# Altium schematic sheet CONNS.SchDoc
size A4; SheetNumber: 9; SheetTotal: 9
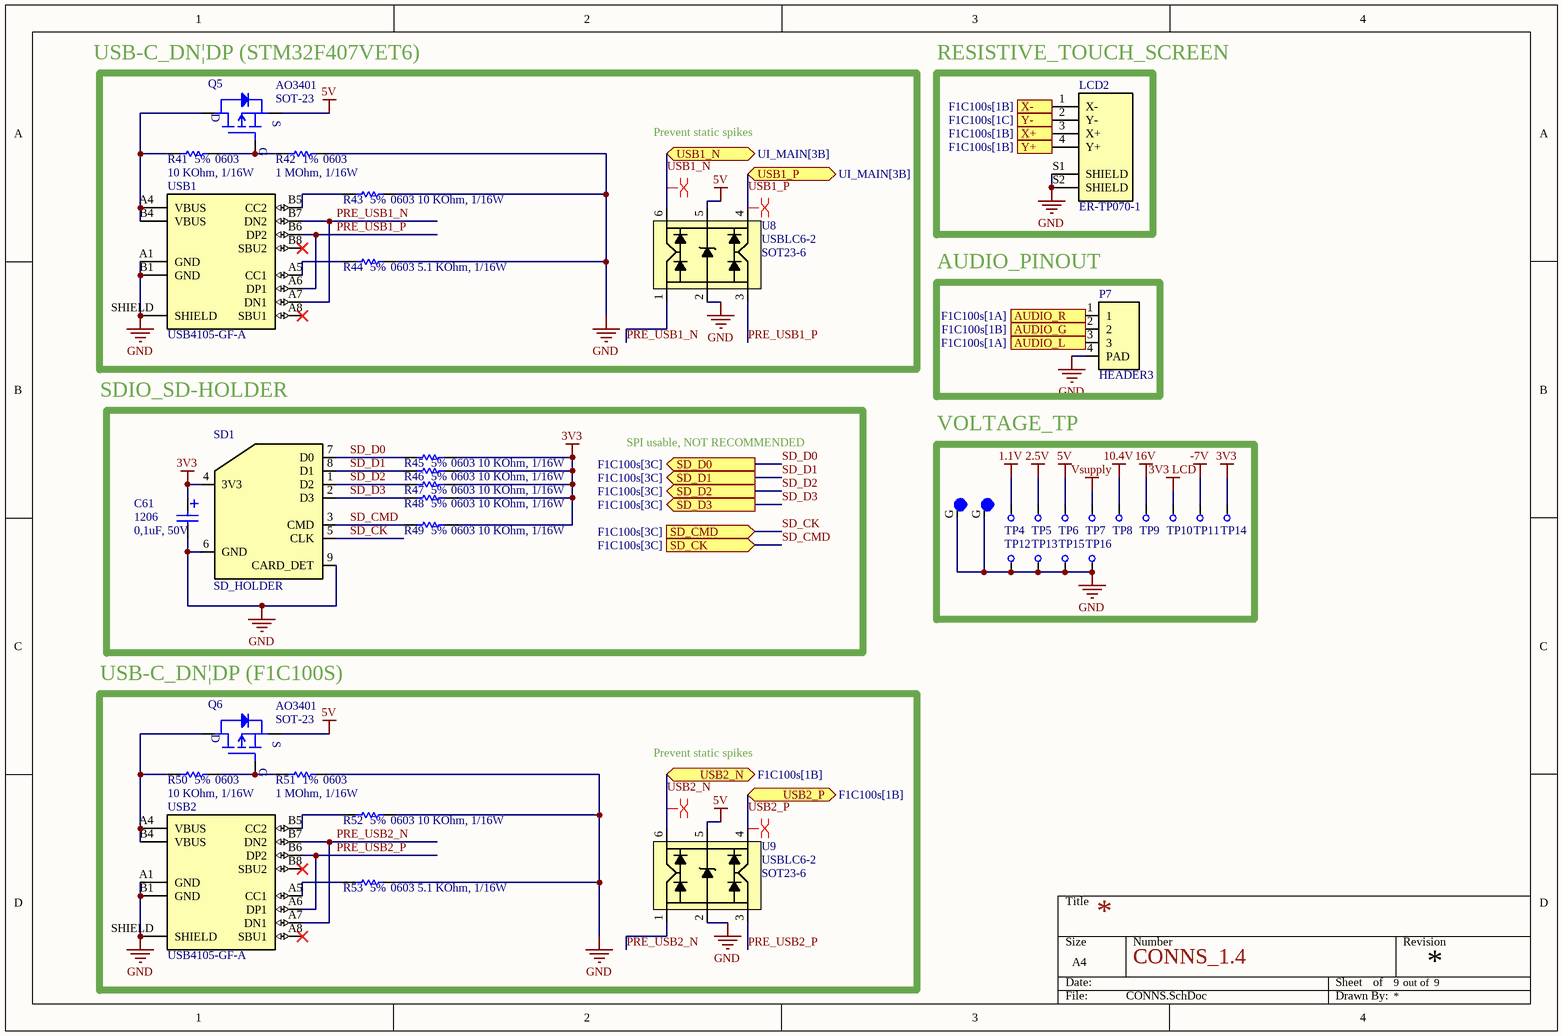
[diagram p0: CONNS.SchDoc]

## Parts
C61  Package: 1206  [C_1206+]  (hidden comment: 0,1uF, 50V)
LCD2  ER-TP070-1  [ER-TP070-1]
M1  MOUNTING_HOLE  [HOLES]  (value not drawn)  (no BOM)
M2  MOUNTING_HOLE  [HOLES]  (value not drawn)  (no BOM)
P7  HEADER3  [CONN_Header3]
Q5  AO3401  Package: SOT-23  [PKG_SOT-23]
Q6  AO3401  Package: SOT-23  [PKG_SOT-23]
R41  Package: 0603  Acc: 5%  [R_0603]  (hidden comment: 10 KOhm, 1/16W)
R42  Package: 0603  Acc: 1%  [R_0603]  (hidden comment: 1 MOhm, 1/16W)
R43  Package: 0603  Acc: 5%  [R_0603]  (hidden comment: 10 KOhm, 1/16W)
R44  Package: 0603  Acc: 5%  [R_0603]  (hidden comment: 5.1 KOhm, 1/16W)
R45  Package: 0603  Acc: 5%  [R_0603]  (hidden comment: 10 KOhm, 1/16W)
R46  Package: 0603  Acc: 5%  [R_0603]  (hidden comment: 10 KOhm, 1/16W)
R47  Package: 0603  Acc: 5%  [R_0603]  (hidden comment: 10 KOhm, 1/16W)
R48  Package: 0603  Acc: 5%  [R_0603]  (hidden comment: 10 KOhm, 1/16W)
R49  Package: 0603  Acc: 5%  [R_0603]  (hidden comment: 10 KOhm, 1/16W)
R50  Package: 0603  Acc: 5%  [R_0603]  (hidden comment: 10 KOhm, 1/16W)
R51  Package: 0603  Acc: 1%  [R_0603]  (hidden comment: 1 MOhm, 1/16W)
R52  Package: 0603  Acc: 5%  [R_0603]  (hidden comment: 10 KOhm, 1/16W)
R53  Package: 0603  Acc: 5%  [R_0603]  (hidden comment: 5.1 KOhm, 1/16W)
SD1  SD_HOLDER  [CONN_SD_Holder]
TP4  TESTPT  [TESTPT]  (value not drawn)  (no BOM)
TP5  TESTPT  [TESTPT]  (value not drawn)  (no BOM)
TP6  TESTPT  [TESTPT]  (value not drawn)  (no BOM)
TP7  TESTPT  [TESTPT]  (value not drawn)  (no BOM)
TP8  TESTPT  [TESTPT]  (value not drawn)  (no BOM)
TP9  TESTPT  [TESTPT]  (value not drawn)  (no BOM)
TP10  TESTPT  [TESTPT]  (value not drawn)  (no BOM)
TP11  TESTPT  [TESTPT]  (value not drawn)  (no BOM)
TP12  TESTPT  [TESTPT]  (value not drawn)  (no BOM)
TP13  TESTPT  [TESTPT]  (value not drawn)  (no BOM)
TP14  TESTPT  [TESTPT]  (value not drawn)  (no BOM)
TP15  TESTPT  [TESTPT]  (value not drawn)  (no BOM)
TP16  TESTPT  [TESTPT]  (value not drawn)  (no BOM)
U8  USBLC6-2  Pkg: SOT23-6  [PKG-SOT23-6]
U9  USBLC6-2  Pkg: SOT23-6  [PKG-SOT23-6]
USB1  USB4105-GF-A  [CONN_USB-C]
USB2  USB4105-GF-A  [CONN_USB-C]

## Blocks framed on the sheet
Prevent static spikes: Q5 R41-R44 U8 USB1
RESISTIVE_TOUCH_SCREEN: LCD2
AUDIO_PINOUT: P7
SPI usable, NOT RECOMMENDED: C61 R45-R49 SD1
VOLTAGE_TP: M1 M2 TP4-TP16
USB-C_DN|DP (F1C100S): Q6 R50-R53 U9 USB2

## Ports
AUDIO_G (in, see F1C100s[1B]), AUDIO_L (in, see F1C100s[1A]), AUDIO_R (in, see F1C100s[1A]), SD_CK (in, see F1C100s[3C]), SD_CMD (in, see F1C100s[3C]), SD_D0 (out, see F1C100s[3C]), SD_D1 (out, see F1C100s[3C]), SD_D2 (out, see F1C100s[3C]), SD_D3 (out, see F1C100s[3C]), USB1_N (bidir, see UI_MAIN[3B]), USB1_P (bidir, see UI_MAIN[3B]), USB2_N (bidir, see F1C100s[1B]), USB2_P (bidir, see F1C100s[1B]), X+ (out, see F1C100s[1B]), X- (out, see F1C100s[1B]), Y+ (out, see F1C100s[1B]), Y- (out, see F1C100s[1C])

## Nets
1.1V: TP4.1
2.5V: TP5.1
3V3: C61.2 R45.2 R46.2 R47.2 R48.2 R49.2 SD1.4(3V3) TP14.1
3V3 LCD: TP10.1
5V: Q5.2(S) Q6.2(S) TP6.1 U8.5 U9.5
10.4V: TP8.1
16V: TP9.1
-7V: TP11.1
GND: C61.1 LCD2.S1(SHIELD) LCD2.S2(SHIELD) M1.G M2.G P7.4(PAD) R42.2 R43.2 R44.2 R51.2 R52.2 R53.2 SD1.6(GND) SD1.9(CARD_DET) TP12.1 TP13.1 TP15.1 TP16.1 U8.2 U9.2 USB1.A1(GND) USB1.B1(GND) USB1.SHIELD USB2.A1(GND) USB2.B1(GND) USB2.SHIELD
Vsupply: TP7.1
AUDIO_G: P7.2 ; port AUDIO_G
AUDIO_L: P7.3 ; port AUDIO_L
AUDIO_R: P7.1 ; port AUDIO_R
PRE_USB1_N: U8.1 USB1.A7(DN1) USB1.B7(DN2)
PRE_USB1_P: U8.3 USB1.A6(DP1) USB1.B6(DP2)
PRE_USB2_N: U9.1 USB2.A7(DN1) USB2.B7(DN2)
PRE_USB2_P: U9.3 USB2.A6(DP1) USB2.B6(DP2)
SD_CK: SD1.5(CLK) ; port SD_CMD
SD_CMD: R49.1 SD1.3(CMD) ; port SD_CK
SD_D0: R45.1 SD1.7(D0) ; port SD_D0
SD_D1: R46.1 SD1.8(D1) ; port SD_D1
SD_D2: R47.1 SD1.1(D2) ; port SD_D2
SD_D3: R48.1 SD1.2(D3) ; port SD_D3
USB1_N: U8.6 ; port USB1_N
USB1_P: U8.4 ; port USB1_P
USB2_N: U9.6 ; port USB2_N
USB2_P: U9.4 ; port USB2_P
X+: LCD2.3(X+) ; port X+
X-: LCD2.1(X-) ; port X-
Y+: LCD2.4(Y+) ; port Y+
Y-: LCD2.2(Y-) ; port Y-
NetQ5_1: Q5.1(G) R41.2 R42.1
NetQ5_3: Q5.3(D) R41.1 USB1.A4(VBUS) USB1.B4(VBUS)
NetQ6_1: Q6.1(G) R50.2 R51.1
NetQ6_3: Q6.3(D) R50.1 USB2.A4(VBUS) USB2.B4(VBUS)
NetR43_1: R43.1 USB1.B5(CC2)
NetR44_1: R44.1 USB1.A5(CC1)
NetR52_1: R52.1 USB2.B5(CC2)
NetR53_1: R53.1 USB2.A5(CC1)

Not connected (* = marked no-connect by the designer): USB1 A8(SBU1)* B8(SBU2)*; USB2 A8(SBU1)* B8(SBU2)*

## Layout directives
differential pair: USB1_N, USB1_P, USB2_N, USB2_P

## Notes on the sheet
- (near Q5) USB-C_DN|DP (STM32F407VET6)
- SDIO_SD-HOLDER
- Prevent static spikes
- CONNS_1.4
- out of

## Library data of the parts
C61 = CAP+1206: Manufacturer 1: OEM; Manufacturer Part Number 1: N/a; Supplier 1: Thegioiic; Datasheet: N/a; Supplier Link: N/a; Value: 0,1uF, 50V
LCD2 = ER-TP070-1: 7 ”Resistive Touch Panel; Manufacturer 1: EastRising; Manufacturer Part Number 1: ER-TP070-1; Supplier 1: trangiahcm; Datasheet: https://www.buydisplay.com/download/manual/ER-TFT070-2_Datasheet.pdf?srsltid=AfmBOoocyeKFVUV0E77nS_42dAg9JdCzPEYk2mMDtH1qp8-WkBG6DKe6; Supplier Link: https://trangiahcm.com/tam-cam-ung-cong-nghiep-7-0-inch-cap-4-chan-164-100-mm-152-86-mm--1740627184.html
P7 = HEADER3: Header 3 pins (2.54mm; Manufacturer 1: OEM; Manufacturer Part Number 1: XH2.54mm 3; Supplier 1: Thegioiic; Datasheet: N/a; Supplier Link: https://www.thegioiic.com/dau-xh2-54mm-3-chan-dan-smd-nam-ngang
Q5 Q6 = AO3401: P-Channel 30 V 4A (Ta) 1.4W (Ta) Surface Mount SOT-23-3; Manufacturer 1: Alpha&Omega Semi.; Manufacturer Part Number 1: AO3401; Supplier 1: ICDayroi; Datasheet: https://www.snapeda.com/parts/AO3401/Alpha%20&%20Omega%20Semiconductor/datasheet/; Supplier Link: https://icdayroi.com/ao3401
R41-R53 = RES_0603: Manufacturer 1: Vishay; Manufacturer Part Number 1: RES0603; Supplier 1: Thegioiic; Datasheet: https://www.mouser.de/datasheet/2/447/PYu_RC_Group_51_RoHS_L_11-1984063.pdf; Supplier Link: N/a
  R41 R43 R45-R50 R52: Value: 10 KOhm, 1/16W
  R42 R51: Value: 1 MOhm, 1/16W
  R44 R53: Value: 5.1 KOhm, 1/16W
SD1 = SD_HOLDER: MICRO SD MEMORY CARD SOCKET; Manufacturer 1: OEM; Manufacturer Part Number 1: MiSD-PP-9P-V1; Supplier 1: Thegioiic; Datasheet: N/a; Supplier Link: https://www.thegioiic.com/misd-pp-9p-v1-khay-the-nho-microsd-9-chan-push-push; Package: MicroSD
TP4-TP16 = TESTPT: Test point
U8 U9 = USBLC6-2: Electrostatic Discharge Protection Device; Manufacturer 1: ST; Manufacturer Part Number 1: USBLC6-2; Supplier 1: icdayroi; Datasheet: https://www.st.com/resource/en/datasheet/usblc6-2.pdf; Supplier Link: https://icdayroi.com/usblc6-2sc6-tvs-diode-5-25v-17v-sot23-6
USB1 USB2 = USB_C: USB Type C Receptacle for USB2.0, SMT Type, PCB Top Mount; Manufacturer 1: GCT; Manufacturer Part Number 1: USB4105-GF-A; Supplier 1: Thegioiic; Datasheet: https://gct.co/files/specs/usb4105-spec.pdf; Supplier Link: https://www.thegioiic.com/cong-usb-cai-3-1-type-c-16-chan-thang-dan-smd; Supplier Link 2: https://www.digikey.com/en/products/detail/gct/USB4105-GF-A/11198510
M1 M2 = MOUNTING_HOLE: ComponentLink1Description: New link; ComponentLink1URL: *